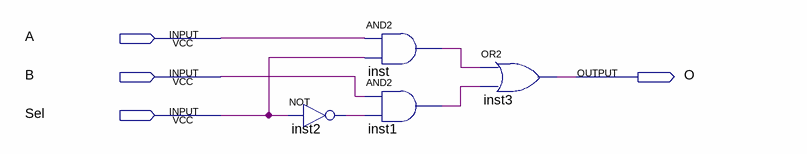
[diagram p0: schematic sheet]
// Quartus schematic Mux2_1bit.bdf as structural Verilog: 4 symbols, 4 pins
module Mux2_1bit (
  input  A,
  input  B,
  input  Sel,
  output O
);

  wire inst1_out, inst2_out, inst_out;

  not inst2 (inst2_out, Sel);
  and inst (inst_out, A, Sel);
  and inst1 (inst1_out, B, inst2_out);
  or inst3 (O, inst_out, inst1_out);
endmodule
